# Altium schematic sheet telemetry_adc.SchDoc: ADC
size A4; Organization: Badgerloop Electrical; Address1: 133 Engineering Research Building; Address2: 1500 Engineering Drive; Address3: Madison, Wi 53706
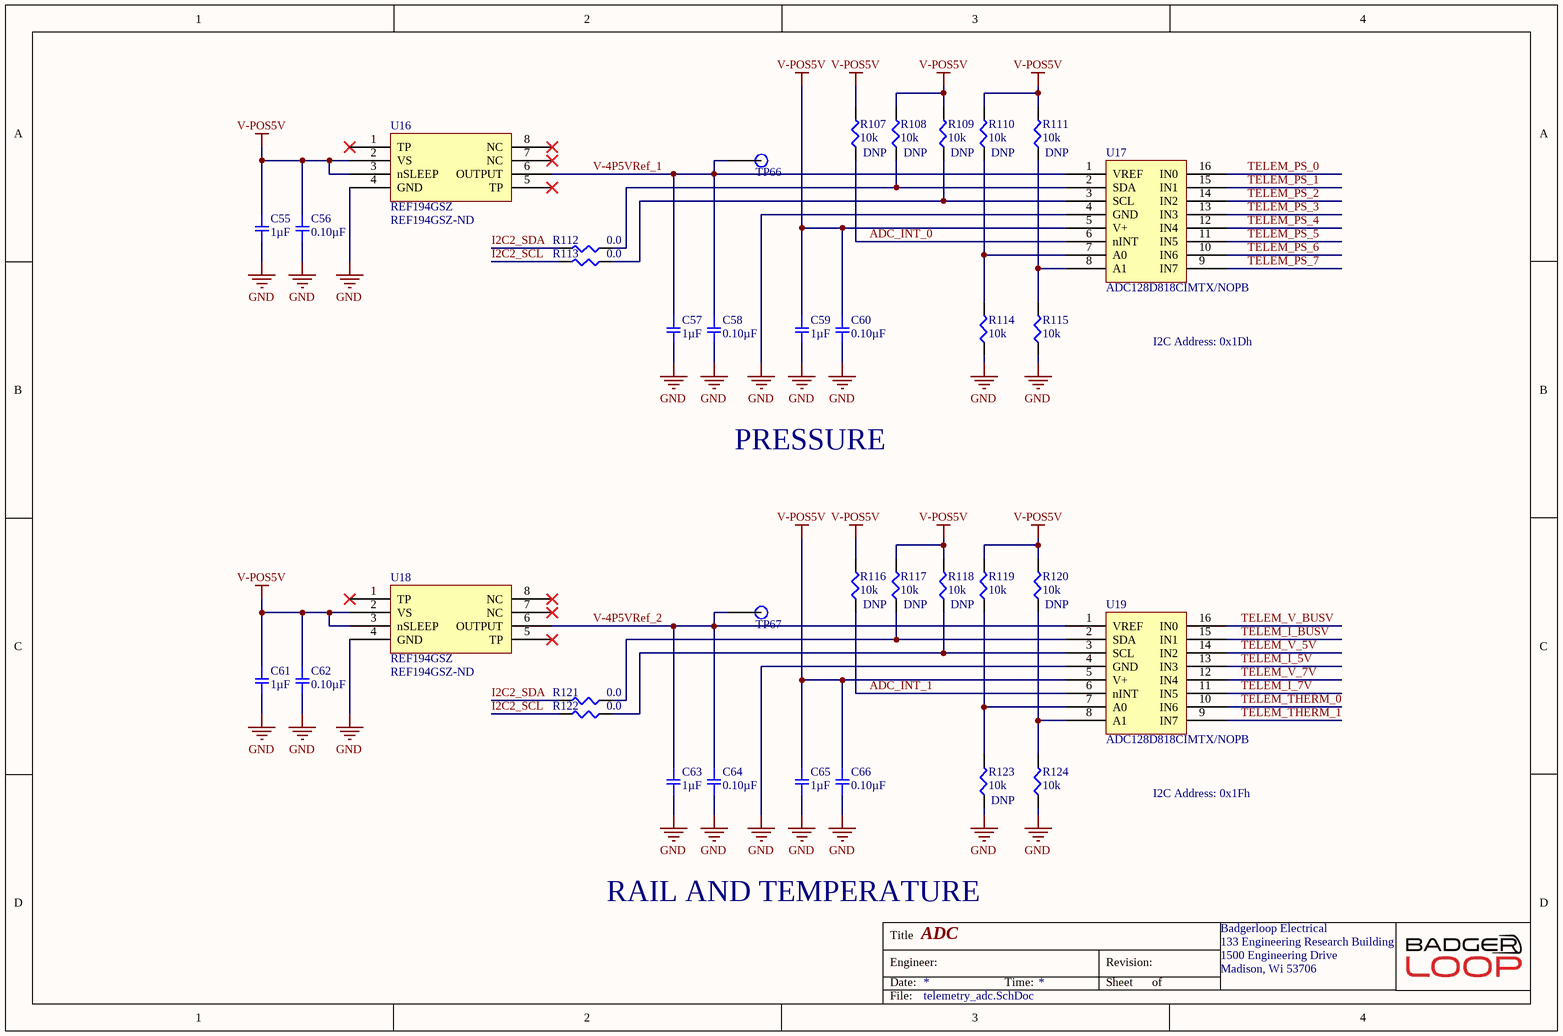
[diagram p0: telemetry_adc.SchDoc]

## Parts
C55  1µF  [SMD-0805C]
C56  0.10µF  [SMD-0805C]
C57  1µF  [SMD-0805C]
C58  0.10µF  [SMD-0805C]
C59  1µF  [SMD-0805C]
C60  0.10µF  [SMD-0805C]
C61  1µF  [SMD-0805C]
C62  0.10µF  [SMD-0805C]
C63  1µF  [SMD-0805C]
C64  0.10µF  [SMD-0805C]
C65  1µF  [SMD-0805C]
C66  0.10µF  [SMD-0805C]
R107  10k  [SMD-0805-RES]
R108  10k  [SMD-0805-RES]
R109  10k  [SMD-0805-RES]
R110  10k  [SMD-0805-RES]
R111  10k  [SMD-0805-RES]
R112  0.0  [SMD-0805-RES]
R113  0.0  [SMD-0805-RES]
R114  10k  [SMD-0805-RES]
R115  10k  [SMD-0805-RES]
R116  10k  [SMD-0805-RES]
R117  10k  [SMD-0805-RES]
R118  10k  [SMD-0805-RES]
R119  10k  [SMD-0805-RES]
R120  10k  [SMD-0805-RES]
R121  0.0  [SMD-0805-RES]
R122  0.0  [SMD-0805-RES]
R123  10k  [SMD-0805-RES]
R124  10k  [SMD-0805-RES]
TP66  TP  [Test Point]  (value not drawn)
TP67  TP  [Test Point]  (value not drawn)
U16  REF194GSZ  Supplier Part Number 1: REF194GSZ-ND  [SOP127P600X175-8N]
U17  ADC128D818CIMTX/NOPB  [TSOP65P660X120-16N]
U18  REF194GSZ  Supplier Part Number 1: REF194GSZ-ND  [SOP127P600X175-8N]
U19  ADC128D818CIMTX/NOPB  [TSOP65P660X120-16N]

## Nets
GND: C55.2 C56.2 C57.2 C58.2 C59.2 C60.2 C61.2 C62.2 C63.2 C64.2 C65.2 C66.2 R114.1 R115.1 R123.1 R124.1 U16.4(GND) U17.4(GND) U18.4(GND) U19.4(GND)
V-POS5V: C55.1 C56.1 C59.1 C60.1 C61.1 C62.1 C65.1 C66.1 R107.2 R108.2 R109.2 R110.2 R111.2 R116.2 R117.2 R118.2 R119.2 R120.2 U16.2(VS) U16.3(nSLEEP) U17.5(V+) U18.2(VS) U18.3(nSLEEP) U19.5(V+)
ADC_INT_0: R107.1 U17.6(nINT)
ADC_INT_1: R116.1 U19.6(nINT)
I2C2_SCL: R113.2 R122.2
I2C2_SDA: R112.2 R121.2
TELEM_I_5V: U19.13(IN3)
TELEM_I_7V: U19.11(IN5)
TELEM_I_BUSV: U19.15(IN1)
TELEM_PS_0: U17.16(IN0)
TELEM_PS_1: U17.15(IN1)
TELEM_PS_2: U17.14(IN2)
TELEM_PS_3: U17.13(IN3)
TELEM_PS_4: U17.12(IN4)
TELEM_PS_5: U17.11(IN5)
TELEM_PS_6: U17.10(IN6)
TELEM_PS_7: U17.9(IN7)
TELEM_THERM_0: U19.10(IN6)
TELEM_THERM_1: U19.9(IN7)
TELEM_V_5V: U19.14(IN2)
TELEM_V_7V: U19.12(IN4)
TELEM_V_BUSV: U19.16(IN0)
V-4P5VRef_1: C57.1 C58.1 TP66.1 U16.6(OUTPUT) U17.1(VREF)
V-4P5VRef_2: C63.1 C64.1 TP67.1 U18.6(OUTPUT) U19.1(VREF)
NetR108_1: R108.1 R112.1 U17.2(SDA)
NetR109_1: R109.1 R113.1 U17.3(SCL)
NetR110_1: R110.1 R114.2 U17.7(A0)
NetR111_1: R111.1 R115.2 U17.8(A1)
NetR117_1: R117.1 R121.1 U19.2(SDA)
NetR118_1: R118.1 R122.1 U19.3(SCL)
NetR119_1: R119.1 R123.2 U19.7(A0)
NetR120_1: R120.1 R124.2 U19.8(A1)

Not connected (* = marked no-connect by the designer): U16 1(TP)* 5(TP)* 7(NC)* 8(NC)*; U18 1(TP)* 5(TP)* 7(NC)* 8(NC)*

## Notes on the sheet
- I2C Address: 0x1Dh
- PRESSURE
- I2C Address: 0x1Fh
- RAIL AND TEMPERATURE
- Title
- Engineer:
- Date:
- Time:
- Revision:
- Sheet
- of
- File:

## Library data of the parts
C55 C57 C59 C61 C63 C65 = GRM21BR71H105KA12L: CAP CER 1UF 50V X7R 0805; Manufacturer: Murata Electronics North America; Factory Stock: 0; Unit Price (USD): 0.25; Minimum Quantity: 1; Tolerance: ±10%; Datasheets: http://www.murata.com/~/media/webrenewal/support/library/catalog/products/capacitor/mlcc/c02e.pdf; Image: //media.digikey.com/Renders/Murata%20Renders/0805%20(2012%20Metric)%20.85mm.jpg; Digi-Key Part Number: 490-4736-1-ND; Part Number: GRM21BR71H105KA12L; Quantity Available: 988032; @ qty: 0; Packaging: Cut Tape (CT); Series: GRM; Part Status: Active; Value: 1µF; Voltage: 50V; Temperature Coefficient: X7R; Operating Temperature: -55°C ~ 125°C; Features: -; Ratings: -; Applications: General Purpose; Mounting Type: Surface Mount, MLCC; Package / Case: 0805 (2012 Metric); Size / Dimension: 0.079" L x 0.049" W (2.00mm x 1.25mm); Height - Seated (Max): -; Thickness (Max): 0.053" (1.35mm); Lead Spacing: -; Lead Style: -
C56 C58 C60 C62 C64 C66 = GCD21BR71H104KA01L: CAP CER 0.1UF 50V X7R 0805; Manufacturer: Murata Electronics North America; Factory Stock: 0; Unit Price (USD): 0.24; Minimum Quantity: 1; Tolerance: ±10%; Datasheets: http://www.murata.com/~/media/webrenewal/support/library/catalog/products/capacitor/mlcc/c03e.ashx; Image: //media.digikey.com/Renders/Murata%20Renders/0805%28GxM6%29.jpg; Digi-Key Part Number: 490-11955-1-ND; Part Number: GCD21BR71H104KA01L; Quantity Available: 157; @ qty: 0; Packaging: Cut Tape (CT); Series: GCD; Part Status: Active; Value: 0.10µF; Voltage: 50V; Temperature Coefficient: X7R; Operating Temperature: -55°C ~ 125°C; Features: -; Ratings: AEC-Q200; Applications: Automotive; Mounting Type: Surface Mount, MLCC; Package / Case: 0805 (2012 Metric); Size / Dimension: 0.079" L x 0.049" W (2.00mm x 1.25mm); Height - Seated (Max): -; Thickness (Max): 0.049" (1.25mm); Lead Spacing: -; Lead Style: -
R107-R111 R114-R120 R123 R124 = ERJ-P06J103V: RES SMD 10K OHM 5% 1/2W 0805; Manufacturer: Panasonic Electronic Components; Factory Stock: 0; Unit Price (USD): 0.01839; @ qty: 1500; Minimum Quantity: 1; Power (Watts): 0.5W, 1/2W; Temperature Coefficient: ±200ppm/°C; Part Number: ERJ-P06J103V; Datasheets: https://industrial.panasonic.com/cdbs/www-data/pdf/RDA0000/AOA0000C243.pdf; Image: //media.digikey.com/Renders/Panasonic%20Renders/ERJ-0805%20Pkg.jpg; Digi-Key Part Number: P10KADCT-ND; Quantity Available: 413576; Packaging: Cut Tape (CT); Series: ERJ; Part Status: Active; Value: 10k; Tolerance: ±5%; Composition: Thick Film; Features: Automotive AEC-Q200, Pulse Withstanding; Operating Temperature: -55°C ~ 155°C; Package / Case: 0805 (2012 Metric); Supplier Device Package: 0805; Size / Dimension: 0.079" L x 0.049" W (2.00mm x 1.25mm); Height - Seated (Max): 0.028" (0.70mm); Number of Terminations: 2; Failure Rate: -
  R107-R111 R116-R118 R120 R123: DNP: DNP
R112 R113 R121 R122 = ERJ-6GEY0R00V: RES SMD 0.0 OHM JUMPER 1/8W 0805; Manufacturer: Panasonic Electronic Components; Factory Stock: 0; Unit Price (USD): 0.00544; @ qty: 1500; Minimum Quantity: 1; Power (Watts): 0.125W, 1/8W; Part Number: ERJ-6GEY0R00V; Datasheets: http://industrial.panasonic.com/www-cgi/jvcr13pz.cgi?E+PZ+3+AOA0001+ERJ6GEY0R00V+7+WW; Image: //media.digikey.com/Renders/Panasonic%20Renders/ERJ-0805%20Pkg.jpg; Digi-Key Part Number: P0.0ACT-ND; Quantity Available: 1597627; Packaging: Cut Tape (CT); Series: ERJ; Part Status: Active; Value: 0.0; Tolerance: Jumper; Composition: Thick Film; Features: Automotive AEC-Q200; Temperature Coefficient: -; Operating Temperature: -55°C ~ 155°C; Package / Case: 0805 (2012 Metric); Supplier Device Package: 0805; Size / Dimension: 0.079" L x 0.049" W (2.00mm x 1.25mm); Height - Seated (Max): 0.028" (0.70mm); Number of Terminations: 2; Failure Rate: -
TP66 TP67 = TP: SMD TEST POINT
U16 U18 = REF194GSZ: IC VREF SERIES 4.5V 8SOIC; Manufacturer: Analog Devices; Max Input Voltage: 18V; Max Output Current: 30mA; Temperature Coefficient: 25ppm/°C; Number of Channels: 1; Min Output Voltage: 4.49V; Operating Supply Current: 45uA; Quiescent Current: 15uA; Min Input Voltage: 4.75V; Supplier 1: Digi-Key; Manufacturer Part Number: REF194GSZ; Stock 1: 359; Pricing 1: 1=3.56000, 10=3.19700, 25=3.02240, 100=2.61940, 250=2.48512, 500=2.22988, 1000=1.88062, 2500=1.78659 (USD); RoHS: Yes; Case/Package: R; Number of Pins: 8; Min Operating Temperature: -40°C; Max Operating Temperature: 85°C; Output Voltage: 4.5V; Packaging: Rail/Tube; Output Current: 30mA; Max Output Voltage: 4.5V; Reference Type: Series; Package Quantity: 98; Nominal Supply Current: 45uA; Reference Voltage: 4.5V; Length: 5mm; Height: 1.5mm; Width: 4mm; Radiation Hardening: No; Lead Free: Contains Lead; REACH SVHC: No SVHC; ComponentLink1URL: https://datasheet.ciiva.com/17219/ref19xseries-17219157.pdf?src-supplier=Avnet+Europe; ComponentLink1Description: https://datasheet.ciiva.com/17219/ref19xseries-17219157.pdf?src-supplier=Avnet+Europe; ComponentLink2URL: https://datasheet.ciiva.com/22666/1506113-22666153.pdf?src-supplier=Element14; ComponentLink2Description: https://datasheet.ciiva.com/22666/1506113-22666153.pdf?src-supplier=Element14; ComponentLink3URL: https://datasheet.ciiva.com/2005/ref19xseries-2005902.pdf?src-supplier=Digi-Key; ComponentLink3Description: https://datasheet.ciiva.com/2005/ref19xseries-2005902.pdf?src-supplier=Digi-Key; ComponentLink4URL: https://datasheet.ciiva.com/3235/ref19xseries-3235518.pdf?src-supplier=Avnet; ComponentLink4Description: https://datasheet.ciiva.com/3235/ref19xseries-3235518.pdf?src-supplier=Avnet
U17 U19 = ADC128D818CIMTX/NOPB: Analog to Digital Converters - ADC; Manufacturer: TI National Semiconductor; Resolution: 12b; Sampling Rate: 10000S/s; Number of A/D Converters: 1; Polarity: Unipolar; Max Supply Voltage: 5.5V; Min Supply Voltage: 3V; Interface: I2C; Number of Channels: 8; Max Power Dissipation: 33mW; Number of Converters: 4; Number of Bits: 12; Integral Nonlinearity (INL): -2LSB; Supply Type: Analog,Digital,Single; Power Consumption: 2mW; Power Dissipation: 2.01mW; Differential Nonlinearity: 1LSB; Supplier 1: Digi-Key; Manufacturer Part Number: ADC128D818CIMTX/NOPB; Stock 1: 21177; Pricing 1: 1=4.68000, 10=4.20700, 100=3.44660, 500=2.93402, 1000=2.47447 (USD); RoHS: Yes; Mount: Surface Mount; Case/Package: TSSOP; Number of Pins: 16; Contact Plating: Tin,Matte; Min Operating Temperature: -40°C; Max Operating Temperature: 125°C; Packaging: Tape and Reel; Package Quantity: 2500; Number of Inputs: 8; Number of Elements: 1; Radiation Hardening: No; Lead Free: Lead Free; ComponentLink1URL: https://datasheet.ciiva.com/14259/adc128d818-14259977.pdf?src-supplier=Avnet; ComponentLink1Description: https://datasheet.ciiva.com/14259/adc128d818-14259977.pdf?src-supplier=Avnet; Supplier Part Number 1: 296-41182-1-ND